# EAGLE design smd_version_01 (EAGLE 6.3)
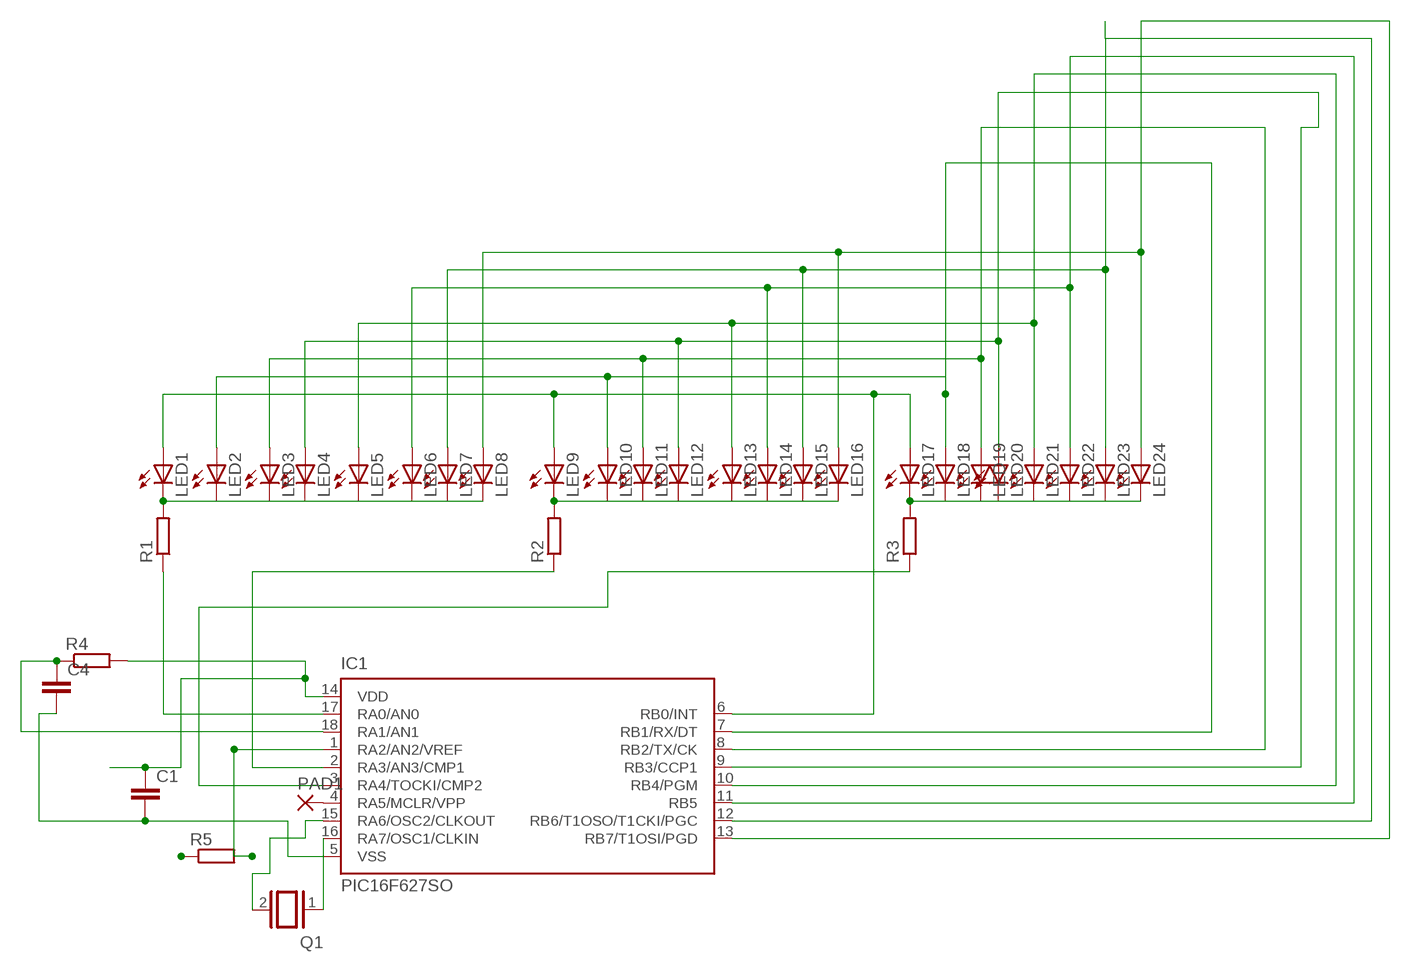
[diagram p0: schematic, sheet 1]

## Parts
C1  C-EUC1825  [C1825]
C4  C-EUC0805  [C0805]
IC1  PIC16F627SO  [SO-18W]
LED1  LEDSMT1206  [1206]
LED2  LEDSMT1206  [1206]
LED3  LEDSMT1206  [1206]
LED4  LEDSMT1206  [1206]
LED5  LEDSMT1206  [1206]
LED6  LEDSMT1206  [1206]
LED7  LEDSMT1206  [1206]
LED8  LEDSMT1206  [1206]
LED9  LEDSMT1206  [1206]
LED10  LEDSMT1206  [1206]
LED11  LEDSMT1206  [1206]
LED12  LEDSMT1206  [1206]
LED13  LEDSMT1206  [1206]
LED14  LEDSMT1206  [1206]
LED15  LEDSMT1206  [1206]
LED16  LEDSMT1206  [1206]
LED17  LEDSMT1206  [1206]
LED18  LEDSMT1206  [1206]
LED19  LEDSMT1206  [1206]
LED20  LEDSMT1206  [1206]
LED21  LEDSMT1206  [1206]
LED22  LEDSMT1206  [1206]
LED23  LEDSMT1206  [1206]
LED24  LEDSMT1206  [1206]
PAD1  SMD2  [SMD1,27-2,54]
Q1  XTAL/S  [QS]
R1  R-EU_0207/15  [0207/15]
R2  R-EU_0207/15  [0207/15]
R3  R-EU_0207/15  [0207/15]
R4  R-EU_M1406  [M1406]
R5  R-EU_0207/12  [0207/12]

## Nets
N$1: LED1.C LED2.C LED3.C LED4.C LED5.C LED6.C LED7.C LED8.C R1.2
N$2: LED9.C LED10.C LED11.C LED12.C LED13.C LED14.C LED15.C LED16.C R2.2
N$3: LED17.C LED18.C LED19.C LED20.C LED21.C LED22.C LED23.C LED24.C R3.2
N$4: IC1.17(RA0/AN0) R1.1
N$5: IC1.2(RA3/AN3/CMP1) R2.1
N$6: IC1.3(RA4/TOCKI/CMP2) R3.1
N$7: IC1.6(RB0/INT) LED1.A LED9.A LED17.A
N$8: IC1.7(RB1/RX/DT) LED2.A LED10.A LED18.A
N$9: IC1.8(RB2/TX/CK) LED3.A LED11.A LED19.A
N$10: IC1.9(RB3/CCP1) LED4.A LED12.A LED20.A
N$11: IC1.10(RB4/PGM) LED5.A LED13.A LED21.A
N$12: IC1.11(RB5) LED6.A LED14.A LED22.A
N$13: IC1.12(RB6/T1OSO/T1CKI/PGC) LED7.A LED15.A LED23.A
N$14: IC1.13(RB7/T1OSI/PGD) LED8.A LED16.A LED24.A
N$15: IC1.4(RA5/MCLR/VPP) PAD1.1(P)
N$16: IC1.16(RA7/OSC1/CLKIN) Q1.1
N$17: IC1.15(RA6/OSC2/CLKOUT) Q1.2
N$19: C1.1 IC1.14(VDD) R4.2
N$20: C1.2 C4.2 IC1.5(VSS)
N$21: C4.1 IC1.18(RA1/AN1) R4.1
N$24: IC1.1(RA2/AN2/VREF) R5.2
N$25: R5.1

## Library data of the parts
C1 C4 = rcl:C-EU: CAPACITOR, European symbol
IC1 = microchip:PIC16F62*: FLASH-Based 8-Bit CMOS Microcontroller Source: http://ww1.microchip.com/downloads/en/DeviceDoc/40300C.pdf
LED1-LED24 = led:LED: LED OSRAM: - CHIPLED LG R971, LG N971, LY N971, LG Q971, LY Q971, LO R971, LY R971 LH N974, LH R974 LS Q976, LO Q976, LY Q976 LO Q996 - Hyper CHIPLED LW Q18S LB Q993, LB Q99A, LB R99A - SideLED LS A670, LO A670, LY A670, LG A670, LP A670 LB A673, LV A673, LT A673, LW A673 LH A674 LY A675 LS A676, LA A676, LO A676, LY A676, LW A676 LS A679, LY A679, LG A679 - Hyper Micro SIDELED® LS Y876, LA Y876, LO Y876, LY Y876 LT Y87S - SmartLED LW L88C, LW L88S LB L89C, LB L89S, LG L890 LS L89K, LO L89K, LY L89K LS L896, LA L896, LO L896, LY L896 - TOPLED LS T670, LO T670, LY T670, LG T670, LP T670 LSG T670, LSP T670, LSY T670, LOP T670, LYG T670 LG T671, LOG T671, LSG T671 LB T673, LV T673, LT T673, LW T673 LH T674 LS T676, LA T676, LO T676, LY T676, LB T676, LH T676, LSB T676, LW T676 LB T67C, LV T67C, LT T67C, LS T67K, LO T67K, LY T67K, LW E67C LS E67B, LA E67B, LO E67B, LY E67B, LB E67C, LV E67C, LT E67C LW T67C LS T679, LY T679, LG T679 LS T770, LO T770, LY T770, LG T770, LP T770 LB T773, LV T773, LT T773, LW T773 LH T774 LS E675, LA E675, LY E675, LS T675 LS T776, LA T776, LO T776, LY T776, LB T776 LHGB T686 LT T68C, LB T68C - Hyper Mini TOPLED® LB M676 - Mini TOPLED Santana® LG M470 LS M47K, LO M47K, LY M47K Source: http://www.osram.convergy.de LUXEON: - LUMILED® LXK2-PW12-R00, LXK2-PW12-S00, LXK2-PW14-U00, LXK2-PW14-V00 LXK2-PM12-R00, LXK2-PM12-S00, LXK2-PM14-U00 LXK2-PE12-Q00, LXK2-PE12-R00, LXK2-PE12-S00, LXK2-PE14-T00, LXK2-PE14-U00 LXK2-PB12-K00, LXK2-PB12-L00, LXK2-PB12-M00, LXK2-PB14-N00, LXK2-PB14-P00, LXK2-PB14-Q00 LXK2-PR12-L00, LXK2-PR12-M00, LXK2-PR14-Q00, LXK2-PR14-R00 LXK2-PD12-Q00, LXK2-PD12-R00, LXK2-PD12-S00 LXK2-PH12-R00, LXK2-PH12-S00 LXK2-PL12-P00, LXK2-PL12-Q00, LXK2-PL12-R00 Source: www.luxeon.com KINGBRIGHT: KA-3528ASYC Source: www.kingbright.com
PAD1 = wirepad:SMD2: SMD PAD
Q1 = special:XTAL/S: CRYSTAL
R1-R3 R5 = rcl:R-EU_: RESISTOR, European symbol
R4 = resistor:R-EU_: RESISTOR, European symbol

## Board
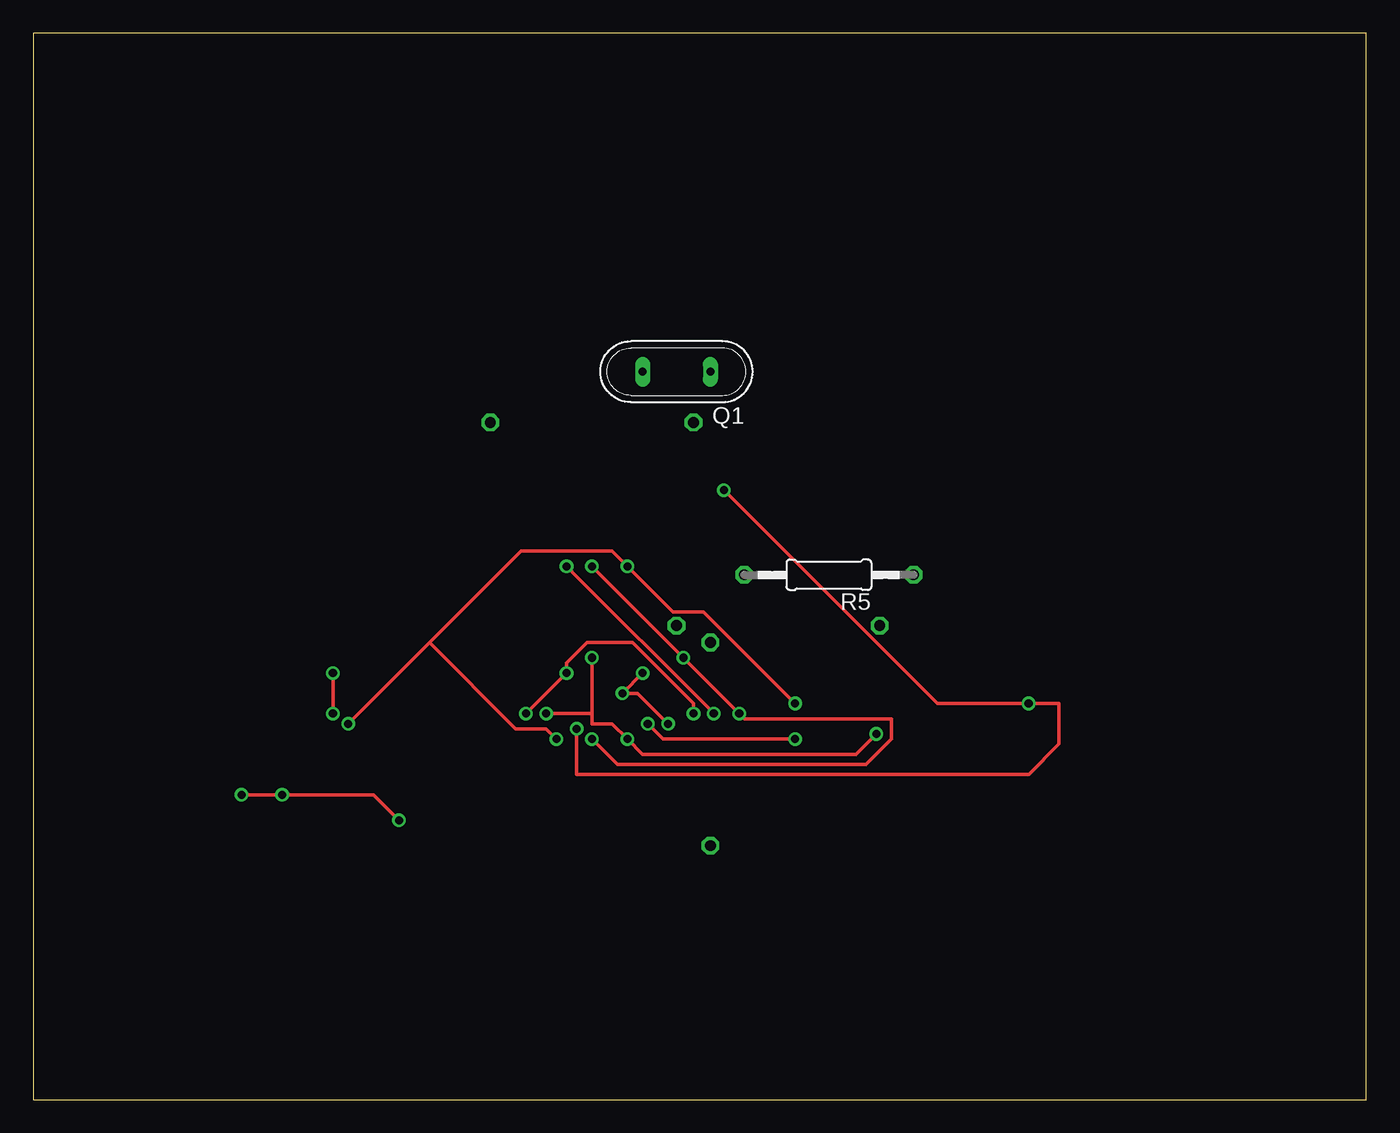
[diagram p1: board, top side]
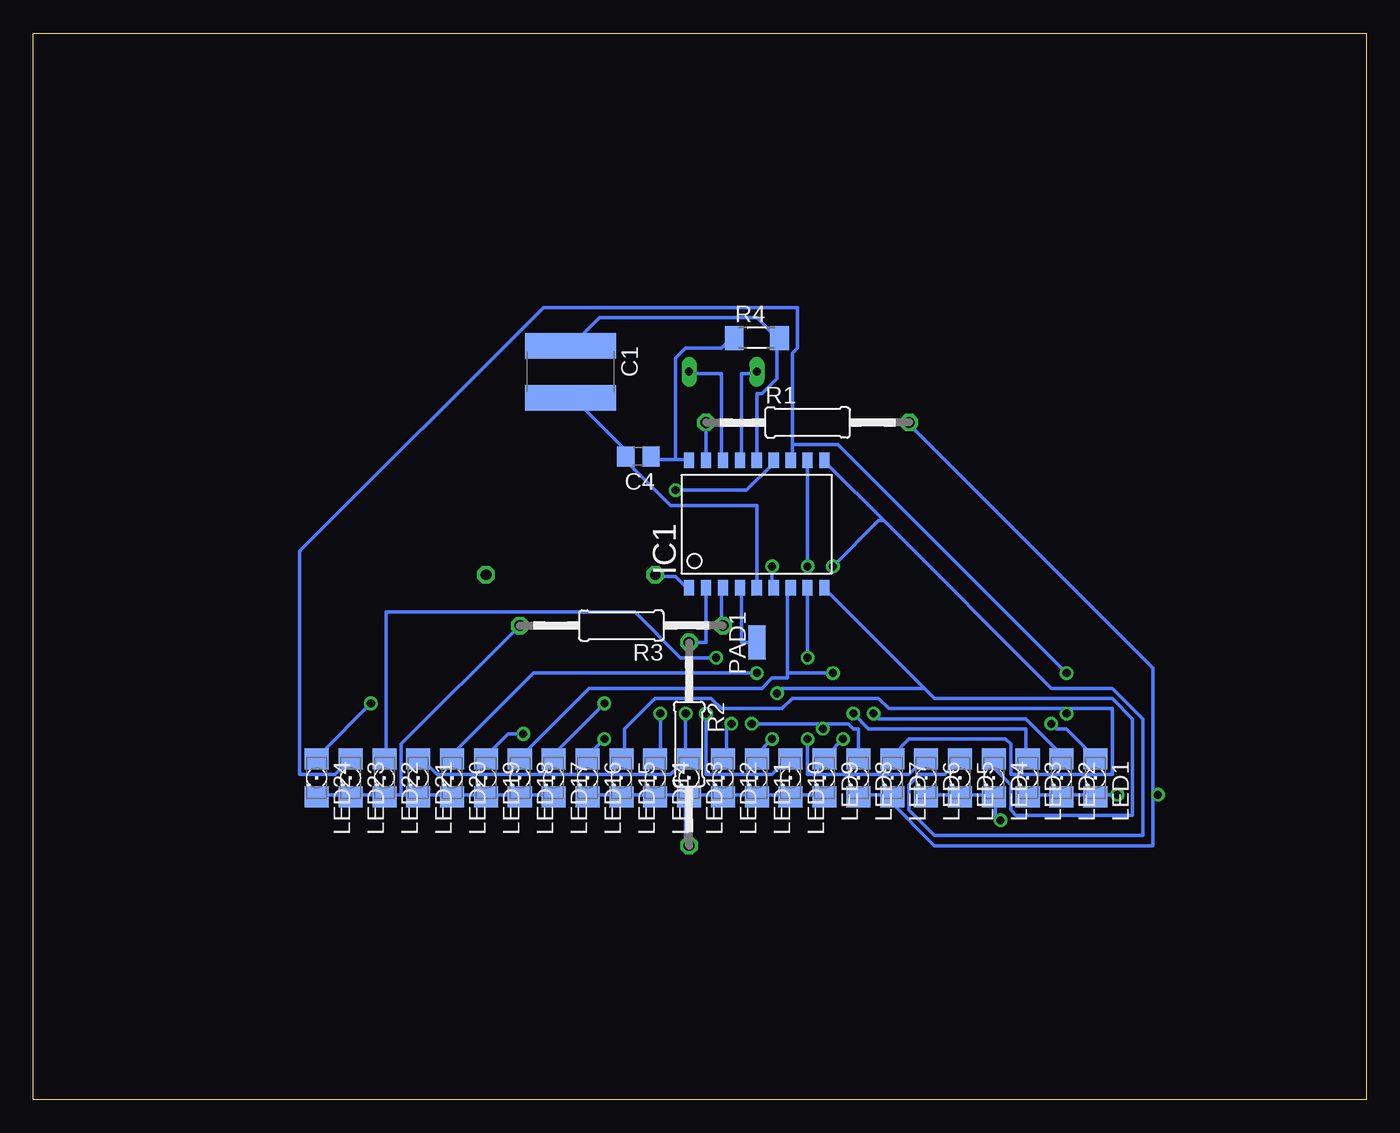
[diagram p2: board, bottom side, seen from below]

Size 100 x 80 mm. Coordinates in mm from the lower left corner, seen from the top.
Outline: 0,0 100,0 100,80 0,80 0,0
Copper layers (1*16): Top 0.035mm / dielectric 1.5mm / Bottom 0.035mm
Design rules "default": minimum track width 10mil, minimum drill 24mil, track to track 8mil, track to pad 8mil, pad to pad 8mil, via to via 8mil, smd to smd 8mil, copper to edge 40mil, drill to drill 8mil, minimum pad ring 10mil, minimum via ring 8mil, stop-mask expansion 4mil, vias tented up to drill 0mil, thermal gap 10mil

### Footprints (pad centres in the part's own frame; a part is rotated, then mirrored left to right if it is on the bottom)
C1825 = smd 1.9 x 6.8: 1 -1.95,0; 2 1.95,0
C0805 = smd 1.3 x 1.5: 1 -0.95,0; 2 0.95,0
SO-18W = smd 0.762 x 1.143: 1 -5.08,-4.788; 2 -3.81,-4.788; 3 -2.54,-4.788; 4 -1.27,-4.788; 5 0,-4.788; 6 1.27,-4.788; 7 2.54,-4.788; 8 3.81,-4.788; 9 5.08,-4.788; 10 5.08,4.788; 11 3.81,4.788; 12 2.54,4.788; 13 1.27,4.788; 14 0,4.788; 15 -1.27,4.788; 16 -2.54,4.788; 17 -3.81,4.788; 18 -5.08,4.788
1206 = smd 1.6 x 1.803: A -1.422,0; C 1.422,0
SMD1,27-2,54 = smd 1.27 x 2.54: 1 0,0
QS = drill 0.61 long: 1 -2.54,0; 2 2.54,0
0207/15 = drill 0.813 octagon: 1 -7.62,0; 2 7.62,0
M1406 = smd 1.4 x 1.8: 1 -1.7,0; 2 1.7,0
0207/12 = drill 0.813 octagon: 1 -6.35,0; 2 6.35,0

### Placement (x,y rotation side)
C1  59.69,54.61 270 bottom
C4  54.61,48.26 180 bottom
IC1  45.72,43.18 0 bottom
LED1  20.32,24.13 270 bottom
LED2  22.86,24.13 270 bottom
LED3  25.4,24.13 270 bottom
LED4  27.94,24.13 270 bottom
LED5  30.48,24.13 270 bottom
LED6  33.02,24.13 270 bottom
LED7  35.56,24.13 270 bottom
LED8  38.1,24.13 270 bottom
LED9  40.64,24.13 270 bottom
LED10  43.18,24.13 270 bottom
LED11  45.72,24.13 270 bottom
LED12  48.26,24.13 270 bottom
LED13  50.8,24.13 270 bottom
LED14  53.34,24.13 270 bottom
LED15  55.88,24.13 270 bottom
LED16  58.42,24.13 270 bottom
LED17  60.96,24.13 270 bottom
LED18  63.5,24.13 270 bottom
LED19  66.04,24.13 270 bottom
LED20  68.58,24.13 270 bottom
LED21  71.12,24.13 270 bottom
LED22  73.66,24.13 270 bottom
LED23  76.2,24.13 270 bottom
LED24  78.74,24.13 270 bottom
PAD1  45.72,34.29 0 bottom
Q1  48.26,54.61 180 top
R1  41.91,50.8 0 bottom
R2  50.8,26.67 270 bottom
R3  55.88,35.56 180 bottom
R4  45.72,57.15 0 bottom
R5  59.69,39.37 180 top

### Tracks (layer width: path | path; a pad name or v marks a point on that pad's centre or on a via)
N$1  (via drill 0.61)
  Top 0.254: v15.62,22.86 v18.67,22.86 25.53,22.86 v27.43,20.95
  Bottom 0.254: 30.48,22.86 28.19,22.86 LED4.C 27.81,22.48 27.81,20.95 v27.43,20.95 | 30.48,22.86 32.77,22.86 LED6.C | 30.48,22.86 LED5.C | 22.86,22.86 20.57,22.86 LED1.C 20.19,22.86 v18.67,22.86 | 22.86,22.86 25.15,22.86 LED3.C | 22.86,22.86 LED2.C | LED8.C 38.1,22.86 35.81,22.86 LED7.C 35.81,22.48 32.38,19.05 16,19.05 16,22.86 | 16,22.86 16,32.38 34.29,50.67 R1.2 | 16,22.86 v15.62,22.86
N$2
  Bottom 0.254: LED9.C 40.77,22.86 43.05,22.86 LED10.C 43.43,22.86 45.72,22.86 | LED16.C 58.29,22.86 56.01,22.86 LED15.C 55.63,22.86 53.34,22.86 | LED13.C 50.67,22.86 48.39,22.86 LED12.C 48.01,22.86 45.72,22.86 | 53.34,22.86 51.05,22.86 LED13.C | R2.2 51.05,19.05 51.05,22.48 LED13.C | 53.34,22.86 LED14.C | 45.72,22.86 LED11.C
N$3
  Bottom 0.254: LED17.C 60.96,22.86 63.25,22.86 LED18.C 63.63,22.86 65.91,22.86 LED19.C 66.29,22.86 68.58,22.86 | 72.39,22.86 73.53,22.86 LED22.C 73.91,22.86 76.2,22.86 | 72.39,22.86 71.25,22.86 LED21.C 70.87,22.86 68.58,22.86 | 76.2,22.86 78.49,22.86 LED24.C | 76.2,22.86 LED23.C | R3.2 72.39,26.67 72.39,22.86 | 68.58,22.86 LED20.C
N$4
  Bottom 0.254: R1.1 IC1.17
N$5
  Bottom 0.254: IC1.2 49.53,34.29 R2.1
N$6
  Bottom 0.254: IC1.3 48.39,38.1 48.39,35.81 R3.1
N$7  (via drill 0.61)
  Top 0.254: v57.15,29.72 50.29,36.58 48.01,36.58 v44.58,40.01 43.43,41.15 36.58,41.15 29.72,34.29 | 29.72,34.29 v23.62,28.19 | v39.24,27.05 38.48,27.81 36.2,27.81 29.72,34.29
  Bottom 0.254: v44.58,40.01 44.58,38.48 IC1.6 | v57.15,29.72 60.96,25.91 LED17.A | v23.62,28.19 23.24,27.81 22.48,27.81 20.57,25.91 LED1.A | v39.24,27.05 40.39,25.91 LED9.A
N$8  (via drill 0.61)
  Top 0.254: v36.96,28.96 v40.01,32 40.01,32.77 41.53,34.29 44.96,34.29 49.53,29.72 v49.53,28.96
  Bottom 0.254: 43.43,32 43.43,31.62 44.58,31.62 45.34,30.86 58.29,30.86 63.25,25.91 LED18.A | 43.43,32 43.43,38.1 IC1.7 | v36.96,28.96 36.58,28.57 25.53,28.57 22.86,25.91 LED2.A | 43.43,32 v40.01,32 | v49.53,28.96 49.53,24.38 44.58,24.38 43.43,25.53 LED10.A
N$9  (via drill 0.61)
  Top 0.254: 41.91,28.96 41.91,28.19 43.43,28.19 v44.58,27.05 45.72,25.91 61.72,25.91 v63.25,27.43 | 41.91,28.96 v41.91,33.15 | 41.91,28.96 v38.48,28.96
  Bottom 0.254: v41.91,33.15 IC1.8 | v44.58,27.05 45.72,25.91 LED11.A | v38.48,28.96 37.34,27.81 25.53,27.81 25.53,25.91 LED3.A | v63.25,27.43 64.39,27.43 65.91,25.91 LED19.A
N$10  (via drill 0.61)
  Top 0.254: v47.62,28.19 45.34,30.48 v44.2,30.48 v45.72,32
  Bottom 0.254: 33.15,30.86 32.38,30.1 19.05,30.1 17.53,28.57 17.53,21.34 26.29,21.34 26.67,21.72 26.67,23.62 27.81,24.77 27.81,25.53 LED4.A | 33.15,30.86 40.39,38.1 IC1.9 | v47.62,28.19 48.01,28.19 48.01,25.91 LED12.A | v44.2,30.48 43.81,30.86 33.15,30.86 | v45.72,32 62.48,32 68.58,25.91 LED20.A
N$11  (via drill 0.61)
  Top 0.254: v40.01,40.01 v51.05,28.96
  Bottom 0.254: LED21.A 70.87,25.53 69.72,24.38 52.2,24.38 51.05,25.53 LED13.A 51.05,25.91 v51.05,28.96 | 36.2,43.43 23.62,30.86 19.05,30.86 16.76,28.57 16.76,19.81 32.38,19.81 34.29,21.72 34.29,23.62 33.53,24.38 31.62,24.38 30.48,25.53 LED5.A | 36.2,43.43 40.39,47.62 IC1.10 | v40.01,40.01 36.58,43.43 36.2,43.43
N$12  (via drill 0.61)
  Top 0.254: v41.91,40.01 v48.77,33.15 v52.96,28.96 53.34,28.57 64.39,28.57 64.39,27.05 62.48,25.15 43.81,25.15 v41.91,27.05
  Bottom 0.254: v41.91,40.01 IC1.11 | v52.96,28.96 52.96,25.91 53.34,25.91 LED14.A | v41.91,27.05 41.91,24.38 34.29,24.38 33.15,25.53 LED6.A | v48.77,33.15 51.44,33.15 54.86,36.58 73.53,36.58 73.53,25.91 LED22.A
N$13  (via drill 0.61)
  Top 0.254: v22.48,32 v22.48,28.96
  Bottom 0.254: 22.48,29.34 35.81,29.34 36.58,30.1 43.05,30.1 43.81,29.34 48.39,29.34 49.15,30.1 53.34,30.1 55.63,27.81 55.63,25.91 LED15.A | 22.48,29.34 19.05,29.34 19.05,24.38 26.67,24.38 26.67,26.67 27.05,27.05 34.29,27.05 35.43,25.91 LED7.A | 43.05,49.15 43.05,56.01 42.67,56.39 42.67,59.44 61.72,59.44 80.01,41.15 80.01,24.38 77.34,24.38 76.2,25.53 LED23.A | 43.05,49.15 43.05,48.01 IC1.12 | v22.48,28.96 22.48,29.34 | v22.48,32 39.62,49.15 43.05,49.15
N$14  (via drill 0.61)
  Top 0.254: v46.1,28.19 47.24,27.05 v57.15,27.05 | v51.82,45.72 67.82,29.72 v74.68,29.72 76.96,29.72 76.96,26.67 74.68,24.38 40.77,24.38 v40.77,27.81
  Bottom 0.254: LED8.A 38.1,27.81 38.48,27.81 38.86,28.19 40.77,28.19 | v46.1,28.19 40.77,28.19 | v57.15,27.05 58.29,25.91 LED16.A | v51.82,45.72 46.48,45.72 44.58,47.62 IC1.13 | v74.68,29.72 78.49,25.91 LED24.A | v40.77,27.81 40.77,28.19
N$15
  Bottom 0.254: PAD1.1 46.86,34.29 46.86,38.1 IC1.4
N$16
  Bottom 0.254: IC1.16 48.39,48.01 48.39,54.48 50.67,54.48 Q1.1
N$17
  Bottom 0.254: IC1.15 46.86,48.01 46.86,54.48 45.72,54.48 Q1.2
N$19
  Bottom 0.254: IC1.14 45.72,52.96 45.34,52.96 44.2,54.1 44.2,57.15 | 44.2,57.15 45.72,58.67 57.53,58.67 59.44,56.77 C1.1 | 44.2,57.15 R4.2
N$20
  Bottom 0.254: IC1.5 45.72,44.58 52.2,44.58 55.63,48.01 C4.2 55.24,48.39 59.44,52.58 C1.2
N$21
  Bottom 0.254: 51.82,48.01 53.34,48.01 C4.1 | 51.82,48.01 51.05,48.01 IC1.18 | 51.82,48.01 51.82,55.63 51.05,56.39 48.39,56.39 47.62,57.15 R4.1
N$24
  Bottom 0.254: IC1.1 51.05,38.48 51.82,39.24 53.34,39.24 R5.2